# EasyEDA Pro project ProPrj_PCB_PCB_OBC-SINAG_2_single-copy_2026-02-04_2026-02-04.epro

# Board PCB_PCB_OBC-SINAG_2_single-copy_2026-02-04
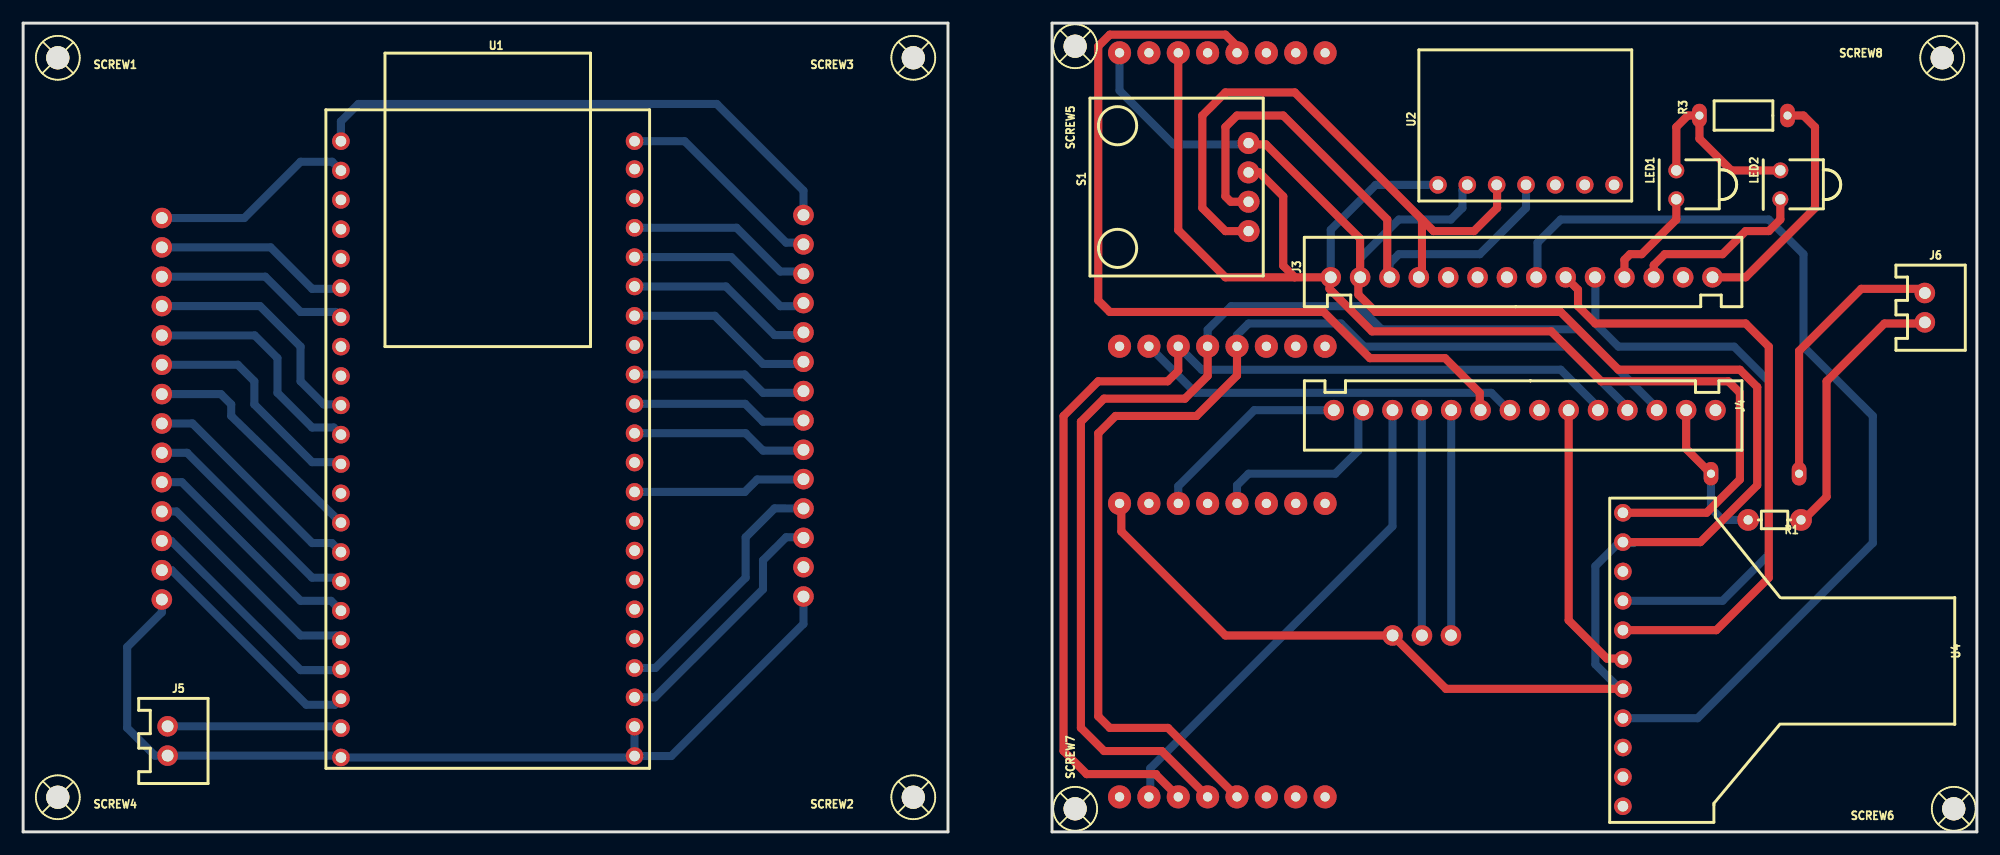
[diagram p0: board, top side]
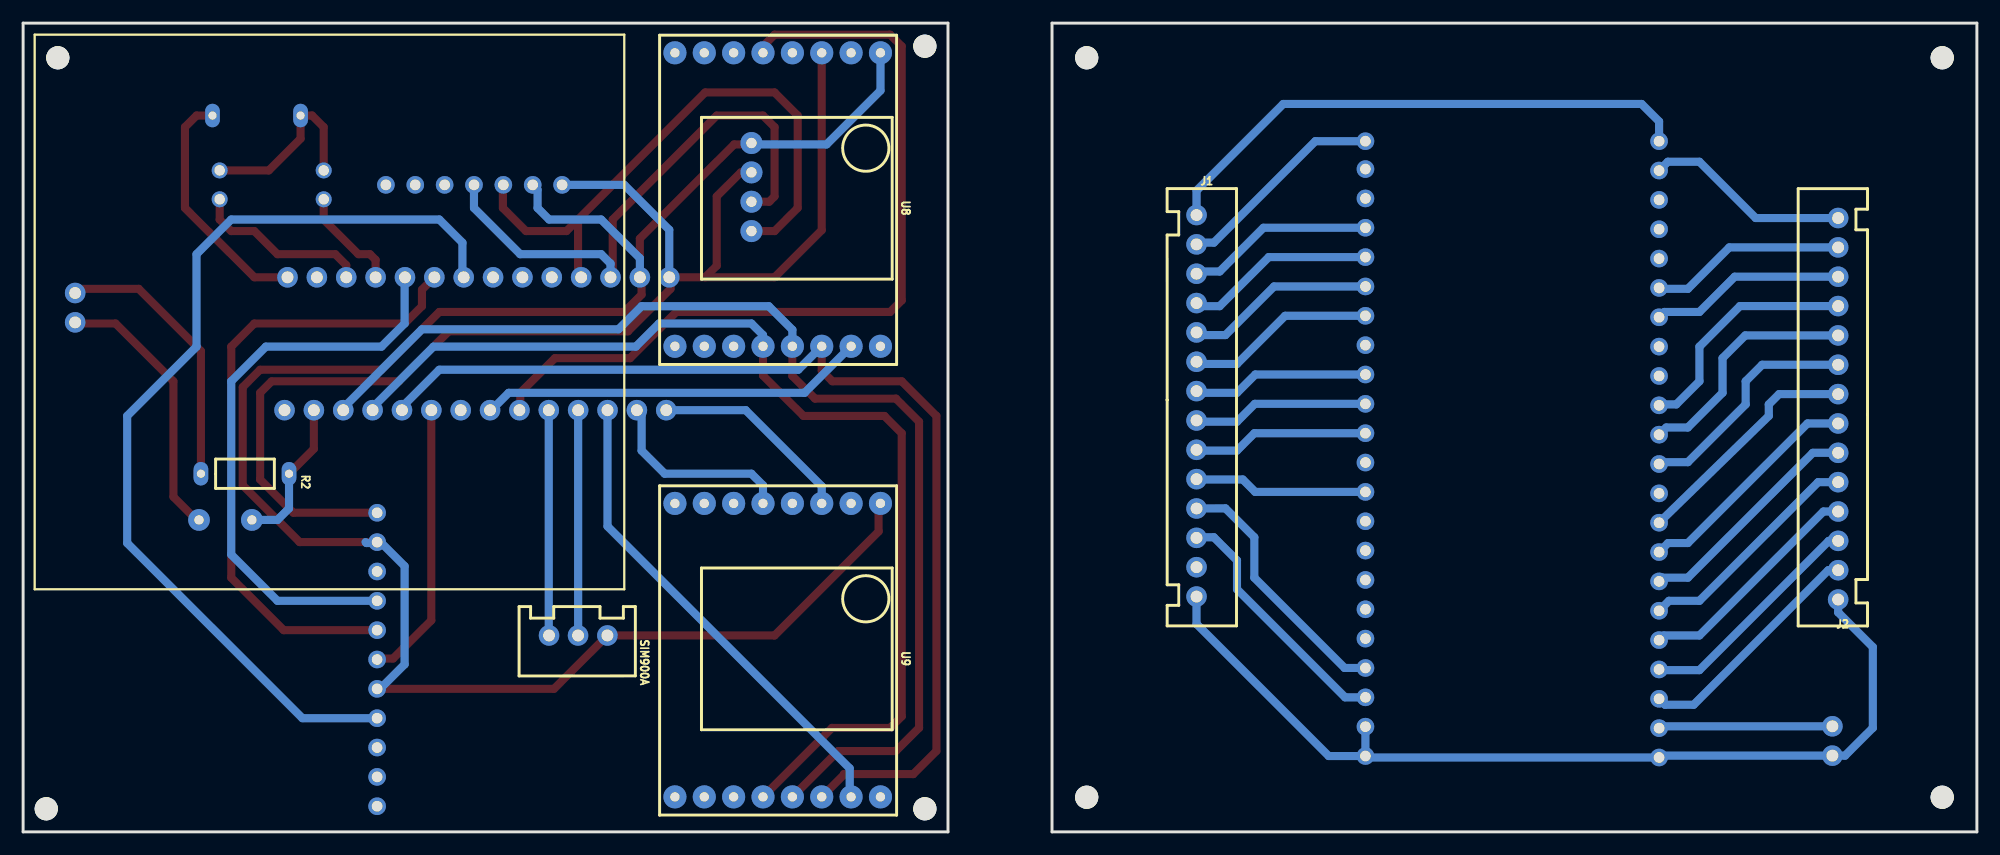
[diagram p1: board, bottom side, seen from below]

Outline 169 x 70 mm; copper layers: Top Layer, Bottom Layer. Coordinates in mm from the lower left corner of the outline.
Outline path: 0,70 0,0 80,0 80,70 0,70 ; 89,70 89,0 169,0 169,70 89,70
Stack: Top Layer 0.035mm / Dielectric1 1.51mm FR4 er 4.5 / Bottom Layer 0.035mm

## Design rules (mm)
spacing Default (default): track to track 0.152, other pairs 0 to 0.152
track width Default (default): min 0.7, default 0.7, max 25.4
differential pair differentialPair (default): width min 0.127, default 0.254, max 2.54; gap min 0.152, default 0.152
via Default (default): diameter min 0.61, default 0.61, max 100.025; hole min 0.305, default 0.305, max 59.995

## Placement (name value [footprint] x y rotation side)
J1  JST-XH_2.54_14_PIN  [14PIN_2.54_MM_JST_XHP_JST_CONNECTOR#2]  67.5 44.5 180 bottom
J2  JST-XH_2.54_14_PIN  [14PIN_2.54_MM_JST_XHP_JST_CONNECTOR#2]  12 29 0 bottom
J3  JST-XH_2.54_14_PIN  [14PIN_2.54_MM_JST_XHP_JST_CONNECTOR]  122 48 90 top
J4  JST-XH_2.54_14_PIN  [14PIN_2.54_MM_JST_XHP_JST_CONNECTOR]  137.5 36.5 270 top
J5  JST_XH2.54_2P  [2PIN_2.54_MM_JST_XHP_JST_CONNECTOR_FOR_DC_SOCKET]  10 11.5 0 top
J6  JST_XH2.54_2P  [2PIN_2.54_MM_JST_XHP_JST_CONNECTOR_FOR_DC_SOCKET]  162 49 0 top
LED1  RED  [LED-TH_LED-DP2-2LED]  143 56 90 top
LED2  GREEN  [LED-TH_LED-DP2-2LED]  152 56 90 top
R1  Thermistor  [AXIAL-0.3-VERT]  151.5 27 180 top
R2  10K  [RESISTOR1/4W]  146 31 270 bottom
R3  50  [RESISTOR1/4W]  145 62 90 top
S1  -  [HTU21D]  106 52 90 top
SCREW1  Screw-M2  [SCREW-M2]  3 67 0 top
SCREW2  Screw-M2  [SCREW-M2]  77 3 0 top
SCREW3  Screw-M2  [SCREW-M2]  77 67 0 top
SCREW4  Screw-M2  [SCREW-M2]  3 3 0 top
SCREW5  Screw-M2  [SCREW-M2]  91 68 0 top
SCREW6  Screw-M2  [SCREW-M2]  167 2 0 top
SCREW7  Screw-M2  [SCREW-M2]  91 2 0 top
SCREW8  Screw-M2  [SCREW-M2]  166 67 0 top
SIM900A  JST_3Pin_2.54mm  [3PIN_2.54_MM_JST_XHP_JST_CONNECTOR-TRUNG]  121 17 270 bottom
U1  ESP32 S3 YD ESP32 S3  [ESP32 S3 YD-ESP32-S3]  44 42 0 top
U2  -  [MS5611-01BA03]  130 56 90 top
U4  AS3935 BREAKOUT COPY  [AS3935]  146 20 270 top
U8  LORA-SX1278-SYMBOL  [LORA-SX1278]  105 56 270 bottom
U9  LORA-SX1278-SYMBOL  [LORA-SX1278]  105 17 270 bottom

## Footprints (pads in the part's own frame, mm; a bottom-side part is the same pattern mirrored in y, then rotated)
2PIN_2.54_MM_JST_XHP_JST_CONNECTOR_FOR_DC_SOCKET
  round 1.778 hole 1.021x1.016: 1(2.498,-2.36) 2(2.498,-4.899)
3PIN_2.54_MM_JST_XHP_JST_CONNECTOR-TRUNG
  round 1.778 hole 1.021x1.016: 1(0,2.54) 2(0,0) 3(-0.002,-2.509)
14PIN_2.54_MM_JST_XHP_JST_CONNECTOR
  round 1.778 hole 1.021x1.016: 1(-0.001,8.889) 2(-0.001,6.349) 3(-0.001,3.809) 4(-0.001,1.27) 5(-0.001,-1.27) 6(-0.001,-3.811) 7(-0.001,-6.351) 8(-0.001,-8.89) 9(-0.001,-11.431) 10(-0.001,-13.97) 11(-0.001,-16.511) 12(-0.001,-19.05) 13(-0.001,-21.59) 14(-0.001,-24.131)
14PIN_2.54_MM_JST_XHP_JST_CONNECTOR#2
  round 1.778 hole 1.021x1.016: 1(0,8.89) 2(0,6.35) 3(0,3.81) 4(0,1.27) 5(0,-1.27) 6(0,-3.81) 7(0,-6.35) 8(0,-8.89) 9(0,-11.43) 10(0,-13.97) 11(0,-16.51) 12(0,-19.05) 13(0,-21.59) 14(0,-24.13)
AS3935
  round 1.524 hole 0.914: 1(-7.62,-7.62) 2(-5.08,-7.62) 3(-2.54,-7.62) 4(0,-7.62) 5(2.54,-7.62) 6(5.08,-7.62) 7(7.62,-7.62) 8(10.16,-7.62) 9(12.7,-7.62) 10(15.24,-7.62) 11(17.78,-7.62)
AXIAL-0.3-VERT
  round 1.879 hole 0.8: 1(-2.286,0) 2(2.286,0)
ESP32 S3 YD-ESP32-S3
  round 1.524 hole 0.914: 1(-16.51,17.78) 2(-16.51,15.24) 3(-16.51,12.7) 4(-16.51,10.16) 5(-16.51,7.62) 6(-16.51,5.08) 7(-16.51,2.54) 8(-16.51,0) 9(-16.51,-2.54) 10(-16.51,-5.08) 11(-16.51,-7.62) 12(-16.51,-10.16) 13(-16.51,-15.24) 14(-16.51,-12.7) 15(-16.51,-17.78) 16(-16.51,-20.32) 17(-16.51,-22.86) 18(-16.51,-25.4) 19(-16.51,-27.94) 20(-16.51,-30.48) 21(-16.51,-33.02) 22(-16.51,-35.56) 23(8.89,-35.433) 24(8.89,-32.893) 25(8.89,-30.353) 26(8.89,-27.813) 27(8.89,-25.273) 28(8.89,-22.733) 29(8.89,-20.193) 30(8.89,-17.653) 31(8.89,-15.113) 32(8.89,-12.573) 33(8.89,-10.033) 34(8.89,-7.493) 35(8.89,-4.953) 36(8.89,-2.413) 37(8.89,0.127) 38(8.89,2.667) 39(8.89,5.207) 40(8.89,7.747) 41(8.89,10.287) 42(8.89,12.827) 43(8.89,15.367) 44(8.89,17.78)
HTU21D
  round 1.905 hole 0.889: 1(0,0) 2(2.54,0) 3(5.08,0) 4(7.62,0)
LED-TH_LED-DP2-2LED
  round 1.38 hole 0.9: 1(-1.25,0) 2(1.25,0)
LORA-SX1278
  round 2 hole 0.8: 1(-11.43,10.16) 2(-11.43,7.62) 3(-11.43,5.08) 4(-11.43,2.54) 5(-11.43,0) 6(-11.43,-2.54) 7(-11.43,-5.08) 8(-11.43,-7.62) 9(13.97,-7.62) 10(13.97,-5.08) 11(13.97,-2.54) 12(13.97,0) 13(13.97,2.54) 14(13.97,5.08) 15(13.97,7.62) 16(13.97,10.16)
MS5611-01BA03
  round 1.524 hole 0.914: 1(0,7.62) 2(0,5.08) 3(0,2.54) 4(0,0) 5(0,-2.54) 6(0,-5.08) 7(0,-7.62)
RESISTOR1/4W
  oval 2.032x1.27 hole 0.7: 1(0,0) 2(0,-7.62)
SCREW-M2
  round 2 hole 2: 1(0,0)

## Nets
3V3_1: J1.1 U1.1
3V3_2: J2.14 U1.2
GND: J1.2 J1.13 J1.14 J2.1 J3.2 J3.13 J3.14 J4.1 J5.2 R3.2 S1.4 SIM900A.1 U1.22 U1.23 U1.24 U1.44 U2.2 U4.2 U4.7 U8.1 U9.1
VCC: J5.1 U1.21
CLK2: J2.4 U1.18
CS1: J1.7
CS2: J2.6 U1.16
CS3: J2.8 U1.13
CS4: J2.12 U1.7
GREEN_LED: J1.12 U1.25
INT1: J2.9 U1.12
INT2: J2.13 U1.6
IRQ1: J1.8 U1.35
IRQ2: J2.7
L3V3_2: J4.14 U9.3
LCLK2: J4.4 U8.12 U9.12
LCS2: J4.6 U4.6
LCS3: J4.8 U8.15
LCS4: J4.12 U9.15
LINT1: J4.9 U8.5
LINT2: J4.13 U9.5
LIRQ2: J4.7
LMISOQ2: J4.3 U8.13 U9.13
LMOSID2: J4.5 U8.14 U9.14
LRXD: J4.11 SIM900A.2
LTPIN: J4.2 R1.2 R2.1
LTXD: J4.10 SIM900A.3
LVCC: J6.2 R1.1
MISOQ1: J1.9 U1.34
MISOQ2: J2.3
MOSID1: J1.10 U1.32
MOSID2: J2.5
R3_1: LED1.2 LED2.2 R3.1
R3V3_1: J3.1 S1.3 U2.1 U4.1 U8.3
RCS1: J3.7
RED_LED: J1.11 U1.26
RGREEN_LED: J3.12 LED2.1
RIRQ1: J3.8 U4.8
RMISOQ1: J3.9 U4.5
RMOSID1: J3.10 U4.4
RRED_LED: J3.11 LED1.1
RSCL1: J3.4 S1.1 U2.3
RSCL2: J3.5
RSDA1: J3.3 S1.2 U2.4
RSDA2: J3.6
RXD: J2.11 U1.10
SCL1: J1.3 U1.41
SCL2: J1.5
SCREW1_1: SCREW1.1
SCREW2_1: SCREW2.1
SCREW3_1: SCREW3.1
SCREW4_1: SCREW4.1
SCREW5_1: SCREW5.1
SCREW6_1: SCREW6.1
SCREW7_1: SCREW7.1
SCREW8_1: SCREW8.1
SDA1: J1.4 U1.40
SDA2: J1.6
TGND: J6.1 R2.2
TPIN: J2.2 U1.20
TXD: J2.10 U1.11

Pads without a net: U1 3 4 5 8 9 14 15 17 19 27 28 29 30 31 33 36 37 38 39 42 43; U2 5 6 7; U4 3 9 10 11; U8 2 4 6 7 8 9 10 11 16; U9 2 4 6 7 8 9 10 11 16

## Routing (per net, layer and track width the routed paths; a pad name or vN(x,y) marks a point on that pad's centre or on a via; arc(x,y) is an arc through that point)
3V3_1: length 47.6
  Bottom Layer w0.7: 67.5,53.39 67.5,55.5 60,63 29,63 27.49,61.49 27.49,59.78
3V3_2: length 17.8
  Bottom Layer w0.7: J2.14 19.13,53.13 24,58 26.73,58 U1.2
GND: length 297.4
  Top Layer w0.7: S1.4 106.12,59.5 107.5,59.5 115.65,51.35 J3.2 115.5,47.85 115.5,46.5 117,45 133,45 138,40 148.5,40 150,38.5 150,30 145.08,25.08 U4.2 ; U9.1 95,28.27 95,26 104,17 SIM900A.1 123.08,12.38 U4.7 ; R3.2 154,62 155,61 155,54 149,48 J3.14
  Bottom Layer w0.7: U1.23 56.07,6.57 67.5,18 J1.14 ; U1.23 52.76,6.44 U1.22 27.33,6.6 11.4,6.6 9,9 9,16 12,19 J2.1 ; U1.23 U1.24 ; 139.38,25.08 139.3,25 138,25 136,23 136,14.5 138.12,12.38 U4.7 ; J1.2 67.35,51 66,51 57.22,59.78 U1.44 ; U8.1 94.84,64.16 99.5,59.5 105.88,59.5 S1.4 ; J3.2 115.65,49.65 119,53 123.5,53 124.5,54 124.5,55.58 U2.2
VCC: length 15.1
  Bottom Layer w0.7: 12.5,9.14 27.33,9.14 U1.21
(no net): length 108.5
  Bottom Layer w0.7: 12,35.35 14.65,35.35 25,25 26.71,25 U1.15 ; 12,25.19 12.81,25.19 24,14 27.43,14 27.49,14.06 ; U1.36 62.41,39.59 64,38 67.35,38 67.5,38.15 ; U1.39 60.79,47.21 65,43 67.27,43 67.5,43.23 ; 12,30.27 13.73,30.27 24,20 26.63,20 27.49,19.14 ; U1.38 59.83,44.67 64,40.5 67.31,40.5 67.5,40.69
CLK2: length 20.1
  Bottom Layer w0.7: 27.49,16.6 27.09,17 24,17 13.27,27.73 J2.4
CS2: length 20.1
  Bottom Layer w0.7: J2.6 14.19,32.81 25,22 27.17,22 U1.16
CS3: length 20.6
  Bottom Layer w0.7: J2.8 17.11,37.89 18,37 18,36 U1.13
CS4: length 16.9
  Bottom Layer w0.7: J2.12 20.95,48.05 24,45 27.03,45 U1.7
GREEN_LED: length 21.8
  Bottom Layer w0.7: 52.89,11.65 54.65,11.65 64,21 64,23.5 66,25.5 67.45,25.5 67.5,25.45
INT1: length 20.2
  Bottom Layer w0.7: J2.9 18.57,40.43 20,39 20,37 25,32 27.33,32 U1.12
INT2: length 17
  Bottom Layer w0.7: J2.13 21.41,50.59 25,47 27.41,47 U1.6
IRQ1: length 15.3
  Bottom Layer w0.7: U1.35 62.45,37.05 64,35.5 67.39,35.5 J1.8
L3V3_2: length 17.7
  Bottom Layer w0.7: U9.3 99.92,29.92 106.5,36.5 J4.14
LCLK2: length 94.7
  Top Layer w0.7: U9.12 99.03,9 94,9 93,10 93,34.5 94.5,36 101.5,36 105,39.5 U8.12
  Bottom Layer w0.7: U8.12 105,43 106,44 114,44 116,42 133.5,42 139,36.5 J4.4
LCS2: length 24.3
  Top Layer w0.7: J4.6 133.69,18.31 137,15 138.3,15 U4.6
LCS3: length 33.5
  Bottom Layer w0.7: J4.8 128.5,36.5 127,38 101.41,38 U8.15
LCS4: length 42.2
  Bottom Layer w0.7: U9.15 97.5,3.15 97.5,5.5 118.45,26.45 J4.12
LINT1: length 73.2
  Top Layer w0.7: J4.9 126,36.57 126,38 123,41 116.5,41 112.5,45 94,45 ; 94,45 93,46 93,68 94,69 104,69 105,68 U8.5
LINT2: length 17
  Bottom Layer w0.7: J4.13 115.5,36.09 115.5,33 113.5,31 106,31 105,30 U9.5
LMISOQ2: length 100.3
  Top Layer w0.7: U9.13 98.49,7 93.5,7 91.5,9 91.5,35.5 93.5,37.5 100.5,37.5 102.46,39.46 U8.13
  Bottom Layer w0.7: U8.13 102.46,43.46 104.5,45.5 115.5,45.5 117.5,43.5 134.5,43.5 141.5,36.5 141.31,36.5
LMOSID2: length 93
  Top Layer w0.7: U9.14 98,4.95 98,5 92,5 90,7 90,36 93,39 99,39 99.92,39.92 U8.14
  Bottom Layer w0.7: U8.14 101.95,40 133,40 136,37 136,36.73 J4.5
LRXD: length 19.5
  Bottom Layer w0.7: J4.11 120.99,17.01 SIM900A.2
LTPIN: length 13
  Top Layer w0.7: J4.2 143.85,33.15 R2.1
  Bottom Layer w0.7: R2.1 146,28 147,27 R1.2
LTXD: length 19.5
  Bottom Layer w0.7: J4.10 123.53,17.02 123.51,17
LVCC: length 23.7
  Top Layer w0.7: J6.2 164.4,44 161,44 156,39 156,29 154,27 R1.1
MISOQ1: length 15.3
  Bottom Layer w0.7: J1.9 67.43,33 64,33 62.49,34.51 U1.34
MOSID1: length 15.1
  Bottom Layer w0.7: J1.10 67.47,30.5 63.5,30.5 62.43,29.43 52.89,29.43
R3_1: length 16.3
  Top Layer w0.7: LED2.2 147.75,57.25 145,60 R3.1 144,62 143,61 LED1.2
R3V3_1: length 115.6
  Top Layer w0.7: 110,48 J3.1 113,47.89 113,47 116.68,43.32 132.18,43.32 136.5,39 147.5,39 148.5,38 148.5,30.5 145.62,27.62 U4.1 ; 110,48 104,48 99.92,52.08 U8.3 ; 110,48 109,49 109,55 106.92,57.08 S1.3
  Bottom Layer w0.7: U2.1 117,56 113.11,52.11 J3.1
RED_LED: length 22.4
  Bottom Layer w0.7: 67.5,27.99 65,28 62.5,25.5 62.5,22 54.69,14.19 52.89,14.19
RGREEN_LED: length 15.4
  Top Layer w0.7: J3.12 141.05,49.05 142,50 147,50 149,52 151,52 152,53 LED2.1
RIRQ1: length 83.5
  Bottom Layer w0.7: J3.8 131,48.11 131,51 133,53 151,53 154,50 154,42 160,36 160,25 144.84,9.84 U4.8
RMISOQ1: length 55.4
  Top Layer w0.7: U4.5 146.46,17.46 151,22 151,42 149,44 136,44 134.5,45.5 134.5,46.93 J3.9
RMOSID1: length 50.4
  Bottom Layer w0.7: J3.10 136,47.97 136,44 138,42 148,42 151,39 151,24 147,20 U4.4
RRED_LED: length 9.2
  Top Layer w0.7: J3.11 138.51,49.51 139,50 140,50 143,53 LED1.1
RSCL1: length 52
  Top Layer w0.7: 121,52.85 121.15,52.85 122,52 125.5,52 127.5,54 127.5,55.96 U2.3 ; J3.4 121,48.27 121,53 110,64 104,64 102,62 102,54 104,52 S1.1
RSDA1: length 48.4
  Top Layer w0.7: S1.2 104.46,54.54 104,55 104,61 105,62 109,62 118,53 118,48.19 J3.3
  Bottom Layer w0.7: J3.3 118.19,49.19 119,50 126,50 130,54 U2.4
RXD: length 20.8
  Bottom Layer w0.7: J2.11 20.49,45.51 24,42 24,39 26,37 27.41,37 27.49,36.92
SCL1: length 16.3
  Bottom Layer w0.7: U1.41 61.71,52.29 65.5,48.5 67.31,48.5 J1.3
SDA1: length 16.5
  Bottom Layer w0.7: J1.4 67.23,45.5 65.5,45.5 61.25,49.75 U1.40
TGND: length 23.9
  Top Layer w0.7: J6.1 164.14,47 159,47 153.62,41.62 R2.2
TPIN: length 20.5
  Bottom Layer w0.7: 27.49,11.52 26.97,11 24.5,11 12.85,22.65 J2.2
TXD: length 20.8
  Bottom Layer w0.7: 27.49,34.38 26.87,35 25,35 22,38 22,41 20.03,42.97 J2.10
